# Altium schematic sheet Sheet2.SchDoc
size A3; SheetNumber: 1; SheetTotal: 1
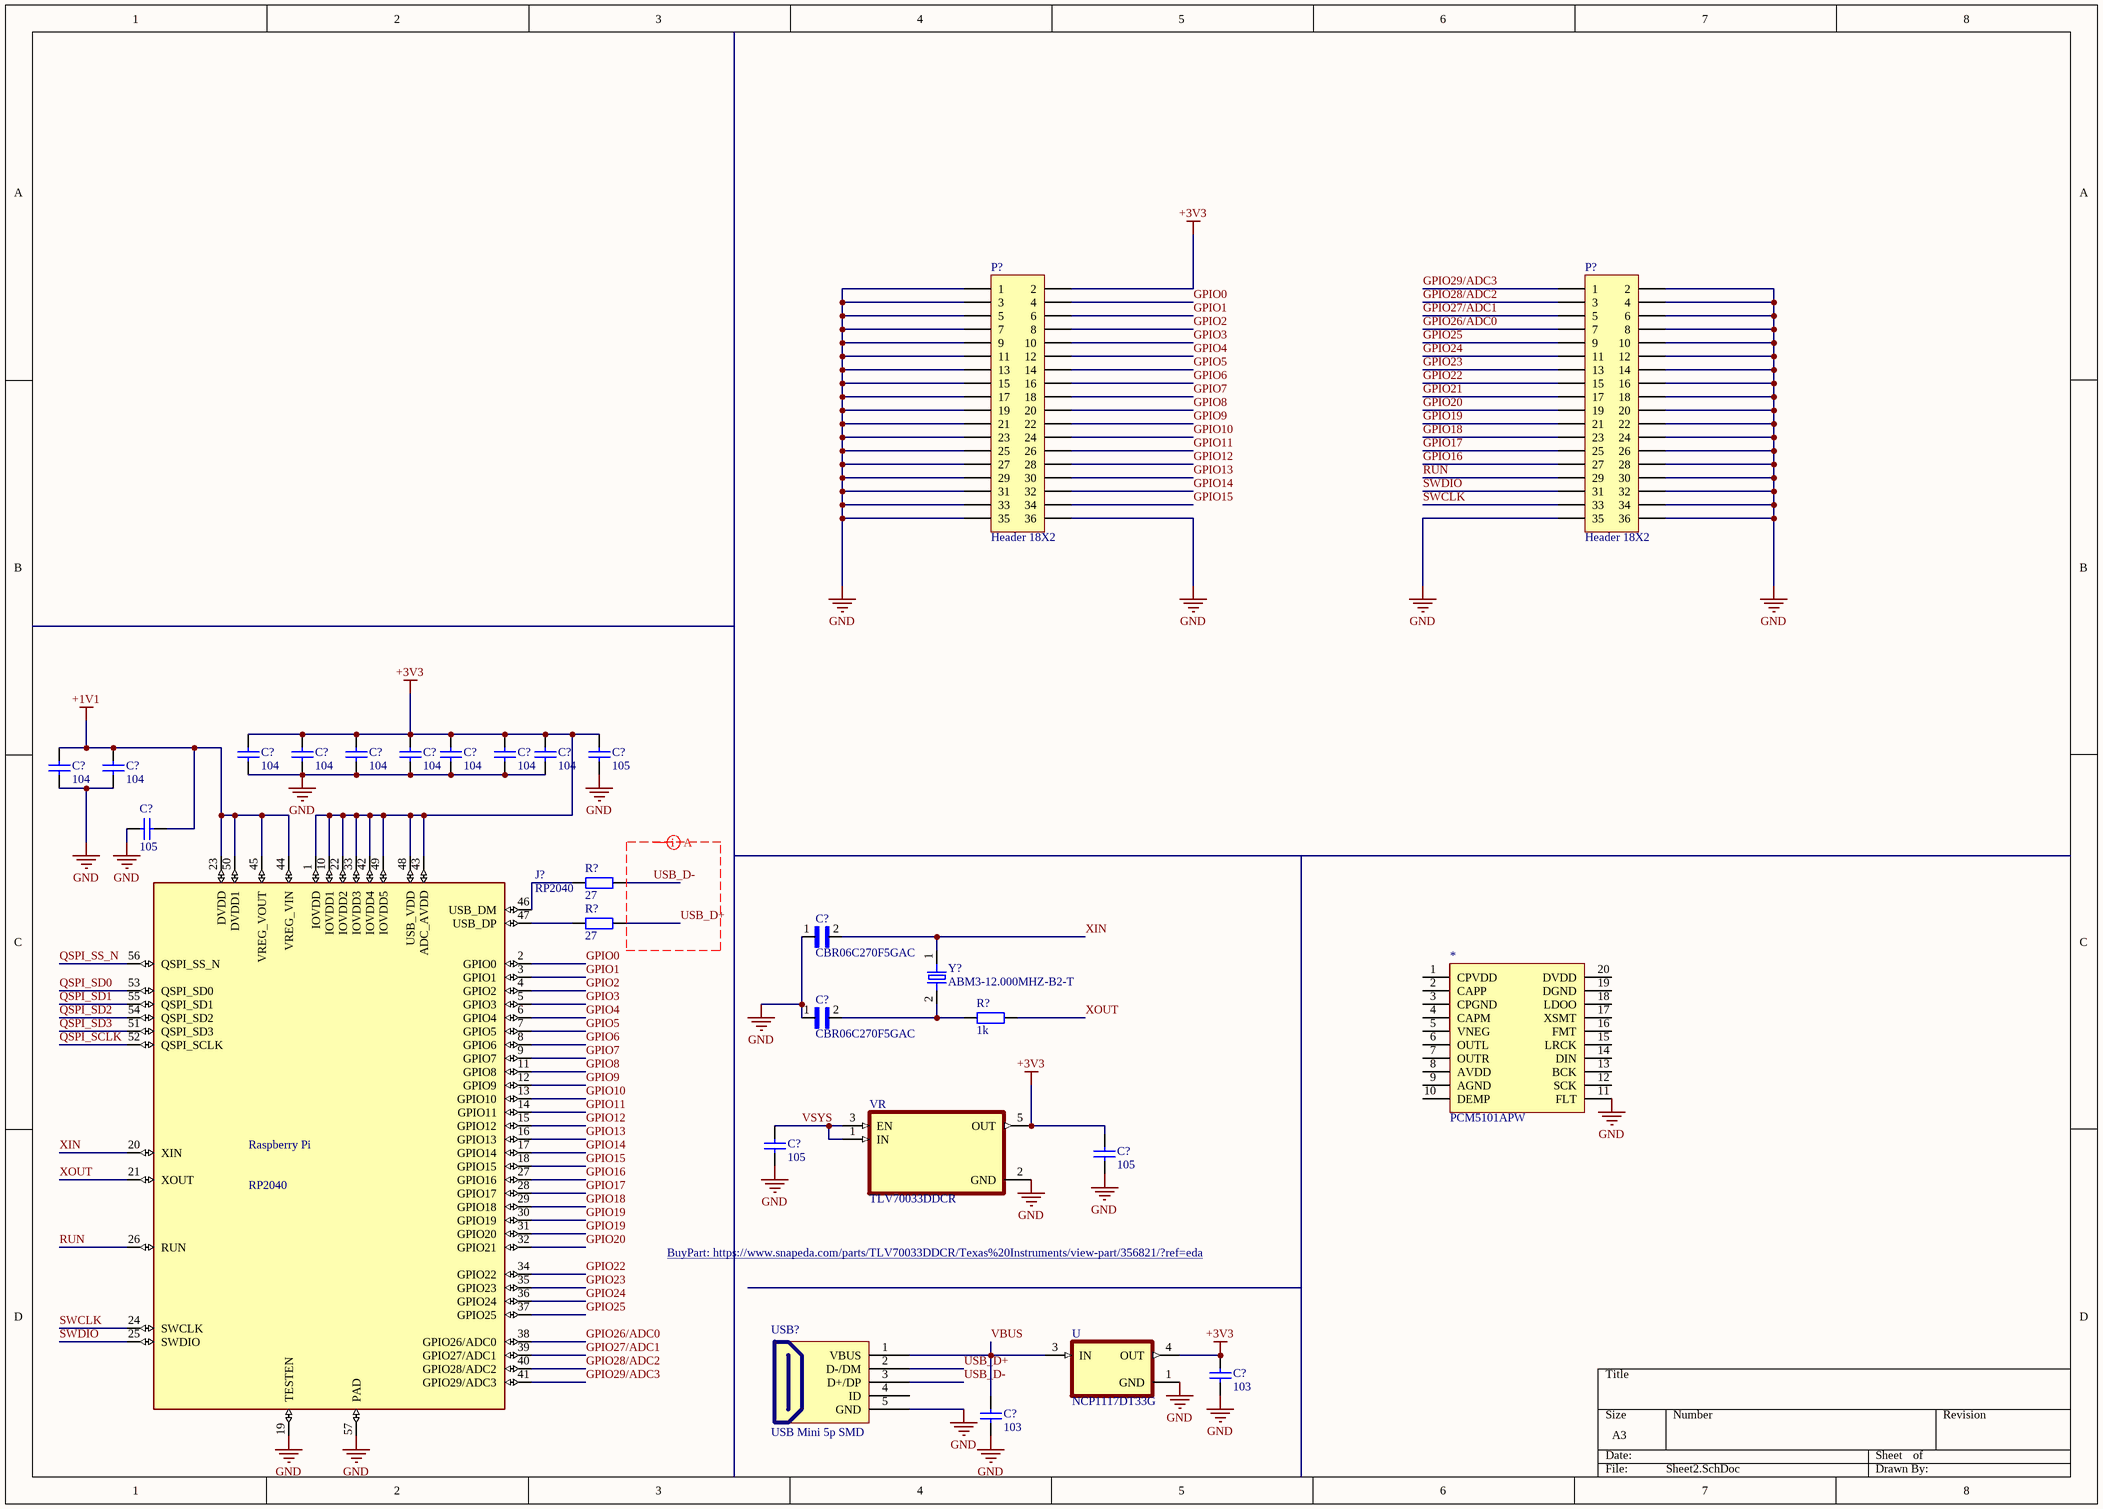
[diagram p0: Sheet2.SchDoc]

## Parts
(Parts that share a designator on the sheet are numbered #1, #2 ... from top to bottom, then left to right.)
*  PCM5101APW  [PCM5101APW]
C?#1  104  [tu 0805]
C?#2  104  [tu 0805]
C?#3  104  [tu 0805]
C?#4  104  [tu 0805]
C?#5  104  [tu 0805]
C?#6  104  [tu 0805]
C?#7  104  [tu 0805]
C?#8  105  [tu 1206]
C?#9  104  [tu 0805]
C?#10  104  [tu 0805]
C?#11  105  [tu 1206]
C?#12  CBR06C270F5GAC  [CAPC1608X87N]
C?#13  CBR06C270F5GAC  [CAPC1608X87N]
C?#14  105  [tu 0805]
C?#15  105  [tu 0805]
C?#16  103  [tu 1206]
C?#17  103  [tu 1206]
J?  RP2040  [QFN40P695X695X90-57T320N]
P?#1  Header 18X2  [HDR2X18]
P?#2  Header 18X2  [HDR2X18]
R?#1  27  [tro smd 0805]
R?#2  27  [tro smd 0805]
R?#3  1k  [tro smd 0805]
U  NCP1117DT33G  [VREG_NCP1117DT33G]
USB?  USB Mini 5p SMD  [USB Mini 5p SMD]
VR  TLV70033DDCR  [SOT95P280X110-5N]
Y?  ABM3-12.000MHZ-B2-T  [XTAL500X320X130N]

## Nets
+1V1: C?#9.2 C?#10.2 C?#11.2 J?.23(DVDD) J?.44(VREG_VIN) J?.45(VREG_VOUT) J?.50(DVDD1)
+3V3: C?#1.2 C?#2.2 C?#3.2 C?#4.2 C?#5.2 C?#6.2 C?#7.2 C?#8.1 C?#15.2 C?#16.2 J?.1(IOVDD) J?.10(IOVDD1) J?.22(IOVDD2) J?.33(IOVDD3) J?.42(IOVDD4) J?.43(ADC_AVDD) J?.48(USB_VDD) J?.49(IOVDD5) P?#1.2 U.4(OUT) VR.5(OUT)
GND: *.11(FLT) C?#1.1 C?#2.1 C?#3.1 C?#4.1 C?#5.1 C?#6.1 C?#7.1 C?#8.2 C?#9.1 C?#10.1 C?#11.1 C?#12.1 C?#13.1 C?#14.1 C?#15.1 C?#16.1 C?#17.1 J?.19(TESTEN) J?.57(PAD) P?#1.1 P?#1.3 P?#1.5 P?#1.7 P?#1.9 P?#1.11 P?#1.13 P?#1.15 P?#1.17 P?#1.19 P?#1.21 P?#1.23 P?#1.25 P?#1.27 P?#1.29 P?#1.31 P?#1.33 P?#1.35 P?#1.36 P?#2.2 P?#2.4 P?#2.6 P?#2.8 P?#2.10 P?#2.12 P?#2.14 P?#2.16 P?#2.18 P?#2.20 P?#2.22 P?#2.24 P?#2.26 P?#2.28 P?#2.30 P?#2.32 P?#2.34 P?#2.35 P?#2.36 U.1(GND) USB?.5(GND) VR.2(GND)
GPIO0: J?.2(GPIO0) P?#1.4
GPIO1: J?.3(GPIO1) P?#1.6
GPIO2: J?.4(GPIO2) P?#1.8
GPIO3: J?.5(GPIO3) P?#1.10
GPIO4: J?.6(GPIO4) P?#1.12
GPIO5: J?.7(GPIO5) P?#1.14
GPIO6: J?.8(GPIO6) P?#1.16
GPIO7: J?.9(GPIO7) P?#1.18
GPIO8: J?.11(GPIO8) P?#1.20
GPIO9: J?.12(GPIO9) P?#1.22
GPIO10: J?.13(GPIO10) P?#1.24
GPIO11: J?.14(GPIO11) P?#1.26
GPIO12: J?.15(GPIO12) P?#1.28
GPIO13: J?.16(GPIO13) P?#1.30
GPIO14: J?.17(GPIO14) P?#1.32
GPIO15: J?.18(GPIO15) P?#1.34
GPIO16: J?.27(GPIO16) P?#2.27
GPIO17: J?.28(GPIO17) P?#2.25
GPIO18: J?.29(GPIO18) P?#2.23
GPIO19: J?.30(GPIO19) J?.31(GPIO20) P?#2.21
GPIO20: J?.32(GPIO21) P?#2.19
GPIO21: P?#2.17
GPIO22: J?.34(GPIO22) P?#2.15
GPIO23: J?.35(GPIO23) P?#2.13
GPIO24: J?.36(GPIO24) P?#2.11
GPIO25: J?.37(GPIO25) P?#2.9
GPIO26/ADC0: J?.38(GPIO26/ADC0) P?#2.7
GPIO27/ADC1: J?.39(GPIO27/ADC1) P?#2.5
GPIO28/ADC2: J?.40(GPIO28/ADC2) P?#2.3
GPIO29/ADC3: J?.41(GPIO29/ADC3) P?#2.1
QSPI_SCLK: J?.52(QSPI_SCLK)
QSPI_SD0: J?.53(QSPI_SD0)
QSPI_SD1: J?.55(QSPI_SD1)
QSPI_SD2: J?.54(QSPI_SD2)
QSPI_SD3: J?.51(QSPI_SD3)
QSPI_SS_N: J?.56(QSPI_SS_N)
RUN: J?.26(RUN) P?#2.29
SWCLK: J?.24(SWCLK) P?#2.33
SWDIO: J?.25(SWDIO) P?#2.31
USB_D+: R?#2.2 USB?.2(D-/DM)
USB_D-: R?#1.2 USB?.3(D+/DP)
VBUS: C?#17.2 U.3(IN) USB?.1(VBUS)
VSYS: C?#14.2 VR.1(IN) VR.3(EN)
XIN: C?#12.2 J?.20(XIN) Y?.1
XOUT: J?.21(XOUT) R?#3.2
NetC?#13_2: C?#13.2 R?#3.1 Y?.2
NetJ?_46: J?.46(USB_DM) R?#1.1
NetJ?_47: J?.47(USB_DP) R?#2.1

Not connected (* = marked no-connect by the designer): * 1(CPVDD) 2(CAPP) 3(CPGND) 4(CAPM) 5(VNEG) 6(OUTL) 7(OUTR) 8(AVDD) 9(AGND) 10(DEMP) 12(SCK) 13(BCK) 14(DIN) 15(LRCK) 16(FMT) 17(XSMT) 18(LDOO) 19(DGND) 20(DVDD); USB? 4(ID)

## Layout directives
net class A: USB_D+, USB_D-

## Library data of the parts
C?#1-C?#7 C?#9 C?#10 = Tu 0805 104 50V 10%: Dán; Don_Vi: Con; So_Chan: 2; Ten_Linh_Kien: Tụ 0805 104-100nF 10% 50V; Ma_Hang: MH004551; Chung_Loai: Dán; Kieu_Chan: *
C?#8 C?#11 = Tu 1206 105 50V 20%: Dán; Don_Vi: Con; So_Chan: 2; Ten_Linh_Kien: Tụ 1206 105-1uF 20% 50V; Ma_Hang: MH004545; Chung_Loai: Dán; Kieu_Chan: *
C?#12 C?#13 = CBR06C270F5GAC: CAP CER 27PF 50V NP0 0603; Package: None; Price: None; Value: *; MP: CBR06C270F5GAC; Availability: Unavailable
C?#14 C?#15 = Tu 0805 105 50V 10%: Dán; Don_Vi: Con; So_Chan: 2; Ten_Linh_Kien: Tụ 0805 105-1uF 10% 50V; Ma_Hang: MH004552; Chung_Loai: Dán; Kieu_Chan: *
C?#16 C?#17 = Tu 1206 103 50V 10%: Dán; Don_Vi: Con; So_Chan: 2; Ten_Linh_Kien: Tụ 1206 103-10nF 10% 50V; Ma_Hang: MH004543; Chung_Loai: Dán; Kieu_Chan: *
J? = RP2040: RP2040 Raspberry Pi Pico - ARMÂ® CortexÂ®-M0+ MCU 32-Bit Embedded Evaluation Board; Value: *; Availability: No availability data; Price: None; SnapEDA_Link: https://www.snapeda.com/parts/RP2040/Raspberry%20Pi/view-part/5800506/?ref=snap; Check_prices: https://www.snapeda.com/parts/RP2040/Raspberry%20Pi/view-part/5800506/?ref=eda; MF: Raspberry Pi; Package: Package; MP: RP2040
P?#1 P?#2 = Header 18X2: Header, 18-Pin, Dual row; LatestRevisionDate: 17-Jul-2002; LatestRevisionNote: Re-released for DXP Platform.; Publisher: Altium Limited
R?#1 R?#2 = Tro 0805 5% 100R: Dán; Don_Vi: Con; So_Chan: 2; Ten_Linh_Kien: Trở 0805 5% 100R; Ma_Hang: MH005251; Chung_Loai: Dán; Kieu_Chan: *
R?#3 = Tro 0805 1% 1k: Dán; Don_Vi: Con; So_Chan: 2; Ten_Linh_Kien: Trở 0805 1% 1k; Ma_Hang: MH005468; Chung_Loai: Dán; Kieu_Chan: *
U = NCP1117DT33G: Linear Voltage Regulator IC 1 Output 1A DPAK; MF: ON Semiconductor; Value: *; Price: None; MP: NCP1117DT33G; Availability: Unavailable; SnapEDA_Link: https://www.snapeda.com/parts/NCP1117DT33G/ON%20Semiconductor/view-part/300669/?ref=snap; Package: DPAK ON Semiconductor
USB? = USB Mini 5p SMD: USB Type B; Ten: MiniUSB 5P SMD; Ma_Hang: MH001022
VR = TLV70033DDCR: 200-mA, high-PSRR, low-IQ, low-dropout voltage regulator with enable 5-SOT-23-THIN -40 to 125; MF: Texas Instruments; Texas_Instruments-Purchase-URL: https://snapeda.com/shop?store=Texas+Instruments&id=356821; Mouser-Purchase-URL: https://snapeda.com/shop?store=Mouser&id=356821; Digi-Key_Part_Number: 296-27937-1-ND; DigiKey-Purchase-URL: https://snapeda.com/shop?store=DigiKey&id=356821; Package: SOT-23-THN-5 Texas Instruments; Value: *; SnapEDA_Link: https://www.snapeda.com/parts/TLV70033DDCR/Texas%20Instruments/view-part/356821/?ref=snap; MP: TLV70033DDCR; BuyPart: https://www.snapeda.com/parts/TLV70033DDCR/Texas%20Instruments/view-part/356821/?ref=eda
Y? = ABM3-12.000MHZ-B2-T: 12MHz Â±20ppm Crystal 18pF 60 Ohms 2-SMD, No Lead; MF: Abracon; Package: SMD-2 Abracon; Purchase-URL: https://pricing.snapeda.com/search/part/ABM3-12.000MHZ-B2-T/?ref=eda; MP: ABM3-12.000MHZ-B2-T; Price: None; Value: *; Availability: Good; SnapEDA_Link: https://www.snapeda.com/parts/ABM3-12.000MHZ-B2-T/Abracon%20LLC/view-part/106373/?ref=snap; Check_prices: https://www.snapeda.com/parts/ABM3-12.000MHZ-B2-T/Abracon%20LLC/view-part/106373/?ref=eda